# Altium schematic sheet MM5800.SchDoc
size A
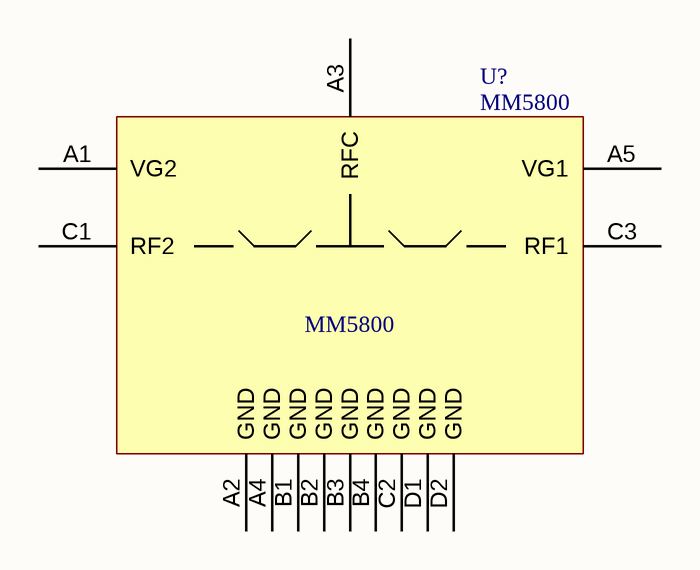
[diagram p0: MM5800.SchDoc]

## Parts
U?  MM5800  [MM5800]

## Nets

Not connected (* = marked no-connect by the designer): U? A1(VG2) A2(GND) A3(RFC) A4(GND) A5(VG1) B1(GND) B2(GND) B3(GND) B4(GND) C1(RF2) C2(GND) C3(RF1) D1(GND) D2(GND)

## Notes on the sheet
- © 2025 Menlo Microsystems, Inc. All rights reserved. This document and the data disclosed herein or herewith are the proprietary and confidential information of Menlo Microsystems, Inc. and may not be reproduced, modified, used, distributed or displayed without separate written permission from Menlo Microsystems, Inc. This document and the data disclosed herein or herewith are provided “AS IS”, with no express or implied warranties.
- REVISION
- DESCRIPTION
- DATE
- APPROVED
- TITLE
- Menlo Microsystems, Inc.
  49 Discovery
  Suite 100
  Irvine, CA 92618
- ENG:
- DSN:
- CHK:
- APPROVALS
- SIZE
- A
- DWG NO.
- SHEET
- OF
- REV

## Library data of the parts
U? = IC-MM5800: Manufacturer: Menlo Micro; Manufacturer_Part_Number: MM5800